# Altium schematic sheet Architecture.SchDoc: System Architecture
size 420 x 297 mm; SheetNumber: 1; SheetTotal: 3; DOC_NO_SCH_DWG: 1
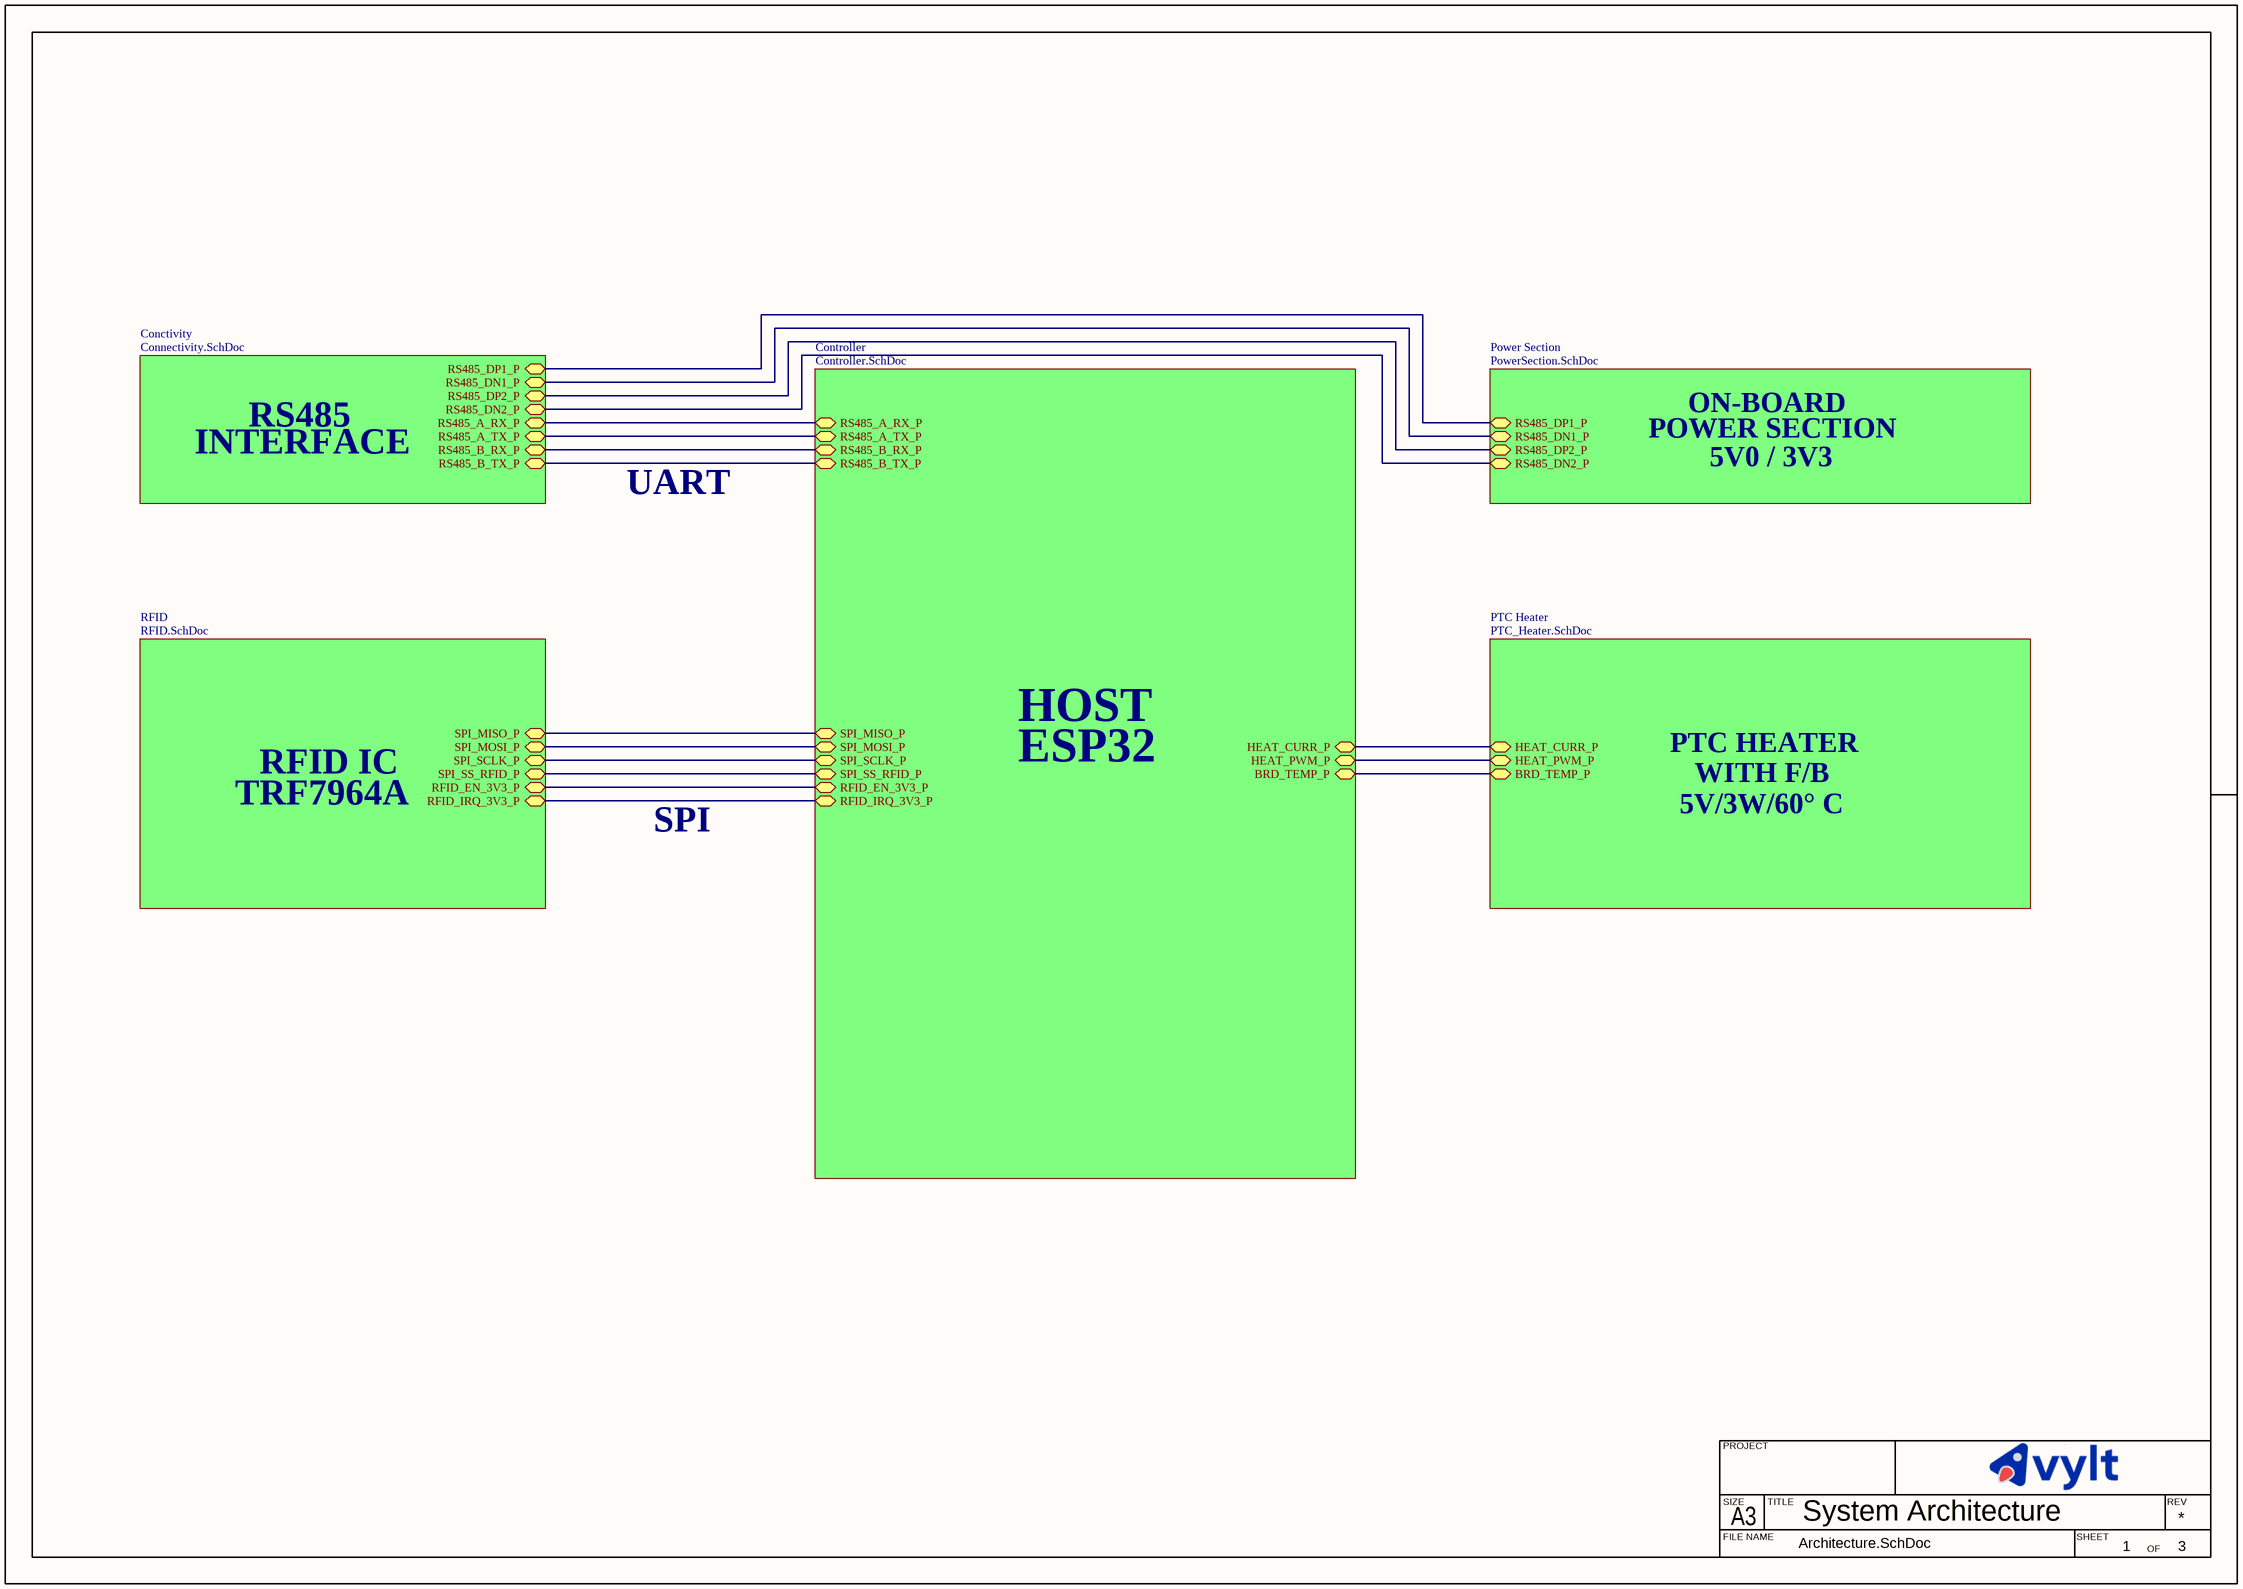
[diagram p0: Architecture.SchDoc]

## Sub-sheets
Conctivity = Connectivity.SchDoc: RS485_A_TX_P (bidir), RS485_A_RX_P (bidir), RS485_DP1_P (bidir), RS485_DN1_P (bidir), RS485_B_TX_P (bidir), RS485_B_RX_P (bidir), RS485_DP2_P (bidir), RS485_DN2_P (bidir)
Controller = Controller.SchDoc: SPI_MOSI_P (bidir), SPI_SCLK_P (bidir), SPI_SS_RFID_P (bidir), RFID_EN_3V3_P (bidir), RFID_IRQ_3V3_P (bidir), RS485_A_TX_P (bidir), RS485_A_RX_P (bidir), SPI_MISO_P (bidir), HEAT_CURR_P (bidir), BRD_TEMP_P (bidir), HEAT_PWM_P (bidir), RS485_B_TX_P (bidir), RS485_B_RX_P (bidir)
Power Section = PowerSection.SchDoc: RS485_DP1_P (bidir), RS485_DN1_P (bidir), RS485_DP2_P (bidir), RS485_DN2_P (bidir)
PTC Heater = PTC_Heater.SchDoc: HEAT_CURR_P (bidir), BRD_TEMP_P (bidir), HEAT_PWM_P (bidir)
RFID = RFID.SchDoc: SPI_MISO_P (bidir), SPI_MOSI_P (bidir), SPI_SCLK_P (bidir), SPI_SS_RFID_P (bidir), RFID_EN_3V3_P (bidir), RFID_IRQ_3V3_P (bidir)

## Nets
(unnamed): sheet RFID/SPI_MISO_P, sheet Controller/SPI_MISO_P
(unnamed): sheet RFID/SPI_MOSI_P, sheet Controller/SPI_MOSI_P
(unnamed): sheet RFID/SPI_SCLK_P, sheet Controller/SPI_SCLK_P
(unnamed): sheet RFID/SPI_SS_RFID_P, sheet Controller/SPI_SS_RFID_P
(unnamed): sheet RFID/RFID_EN_3V3_P, sheet Controller/RFID_EN_3V3_P
(unnamed): sheet RFID/RFID_IRQ_3V3_P, sheet Controller/RFID_IRQ_3V3_P
(unnamed): sheet Controller/RS485_A_TX_P, sheet Conctivity/RS485_A_TX_P
(unnamed): sheet Controller/RS485_A_RX_P, sheet Conctivity/RS485_A_RX_P
(unnamed): sheet Controller/HEAT_CURR_P, sheet PTC Heater/HEAT_CURR_P
(unnamed): sheet Controller/BRD_TEMP_P, sheet PTC Heater/BRD_TEMP_P
(unnamed): sheet Controller/HEAT_PWM_P, sheet PTC Heater/HEAT_PWM_P
(unnamed): sheet Controller/RS485_B_TX_P, sheet Conctivity/RS485_B_TX_P
(unnamed): sheet Controller/RS485_B_RX_P, sheet Conctivity/RS485_B_RX_P
(unnamed): sheet Conctivity/RS485_DP1_P, sheet Power Section/RS485_DP1_P
(unnamed): sheet Conctivity/RS485_DN1_P, sheet Power Section/RS485_DN1_P
(unnamed): sheet Conctivity/RS485_DP2_P, sheet Power Section/RS485_DP2_P
(unnamed): sheet Conctivity/RS485_DN2_P, sheet Power Section/RS485_DN2_P

## Notes on the sheet
- INTERFACE
- RS485
- POWER SECTION
- ON-BOARD
- UART
- 5V0 / 3V3
- HOST
- RFID IC
- ESP32
- PTC HEATER
- WITH F/B
- TRF7964A
- SPI
- 5V/3W/60° C
- PROJECT
- SIZE
- FILE NAME
- A3
- TITLE
- SHEET
- OF
- REV